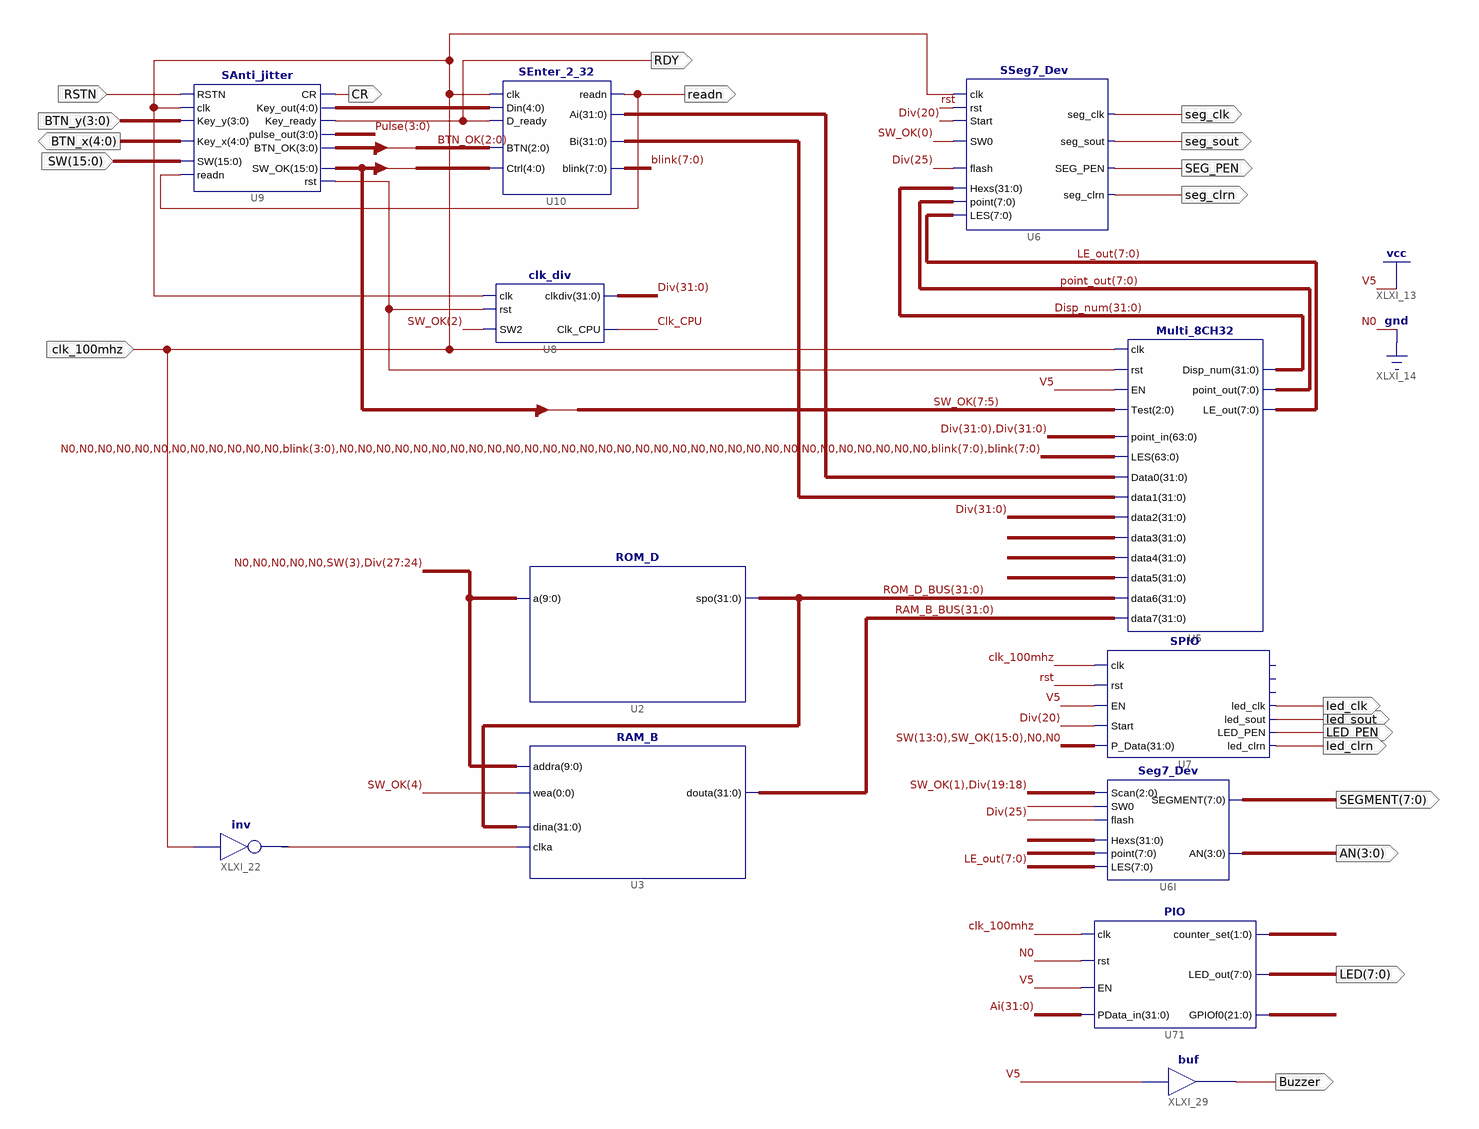
[diagram p0: schematic sheet 1]
// Xilinx ISE schematic OExp01_MUX.sch (kintex7) as structural Verilog: 12 symbols, 20 ports
module OExp01_MUX (
  input  RSTN,
  input  [3:0] BTN_y,
  input  [15:0] SW,
  input  clk_100mhz,
  output seg_clk,
  output seg_sout,
  output SEG_PEN,
  output seg_clrn,
  output readn,
  output CR,
  output RDY,
  output [4:0] BTN_x,
  output led_clrn,
  output LED_PEN,
  output led_sout,
  output led_clk,
  output [3:0] AN,
  output [7:0] SEGMENT,
  output Buzzer,
  output [7:0] LED
);

  wire Clk_CPU, rst, XLXN_40, XLXN_94;
  wire [1:0] XLXN_580;
  wire [3:0] BTN_OK, Pulse;
  wire [4:0] XLXN_35;
  wire [7:0] blink, LE_out, point_out;
  wire [15:0] SW_OK;
  wire [21:0] XLXN_582;
  wire [31:0] Ai, Disp_num, Div, RAM_B_BUS, ROM_D_BUS, XLXN_17, XLXN_19, XLXN_25, XLXN_26, XLXN_27;

  SSeg7_Dev U6 (
    .LES(LE_out), .SEG_PEN(SEG_PEN), .seg_sout(seg_sout), .seg_clrn(seg_clrn), .point(point_out),
    .Hexs(Disp_num), .SW0(SW_OK[0]), .flash(Div[25]), .seg_clk(seg_clk), .clk(clk_100mhz), .rst(rst),
    .Start(Div[20]));
  clk_div U8 (.rst(XLXN_40), .clk(clk_100mhz), .SW2(SW_OK[2]), .clkdiv(Div), .Clk_CPU(Clk_CPU));
  Multi_8CH32 U5 (
    .Test(SW_OK[7:5]), .point_in({Div, Div}), .EN(1'b1), .clk(clk_100mhz), .rst(XLXN_40),
    .LES({{12{1'b0}}, blink[3:0], {32{1'b0}}, blink, blink}), .Data0(XLXN_17), .data1(XLXN_19), .data2(Div),
    .data3(XLXN_25), .data4(XLXN_26), .data5(XLXN_27), .data6(ROM_D_BUS), .data7(RAM_B_BUS),
    .point_out(point_out), .LE_out(LE_out), .Disp_num(Disp_num));
  SEnter_2_32 U10 (
    .readn(readn), .Ai(XLXN_17), .Bi(XLXN_19), .blink(blink), .Din(XLXN_35), .D_ready(RDY), .clk(clk_100mhz),
    .Ctrl({SW_OK[7:5], SW_OK[15], SW_OK[0]}), .BTN(BTN_OK[2:0]));
  SAnti_jitter U9 (
    .SW(SW), .readn(readn), .Key_y(BTN_y), .Key_x(BTN_x), .RSTN(RSTN), .clk(clk_100mhz), .Key_out(XLXN_35),
    .Key_ready(RDY), .CR(CR), .rst(XLXN_40), .SW_OK(SW_OK), .pulse_out(Pulse), .BTN_OK(BTN_OK));
  RAM_B U3 (
    .addra({{5{1'b0}}, SW[3], Div[27:24]}), .clka(XLXN_94), .wea(SW_OK[4]), .dina(ROM_D_BUS),
    .douta(RAM_B_BUS));
  ROM_D U2 (.a({{5{1'b0}}, SW[3], Div[27:24]}), .spo(ROM_D_BUS));
  not XLXI_22 (XLXN_94, clk_100mhz);
  PIO U71 (
    .clk(clk_100mhz), .rst(1'b0), .EN(1'b1), .PData_in(Ai), .GPIOf0(XLXN_582), .LED_out(LED),
    .counter_set(XLXN_580));
  SPIO U7 (
    .clk(clk_100mhz), .P_Data({SW[13:0], SW_OK, 2'b00}), .rst(rst), .EN(1'b1), .Start(Div[20]),
    .led_clk(led_clk), .led_clrn(led_clrn), .LED_PEN(LED_PEN), .led_sout(led_sout));  // open: GPIOf0, LED_out, counter_set
  Seg7_Dev U6I (
    .LES(LE_out), .Scan({SW_OK[1], Div[19:18]}), .SEGMENT(SEGMENT), .AN(AN), .point(point_out),
    .flash(Div[25]), .SW0(SW_OK[0]), .Hexs(Disp_num));
  buf XLXI_29 (Buzzer, 1'b1);
endmodule
